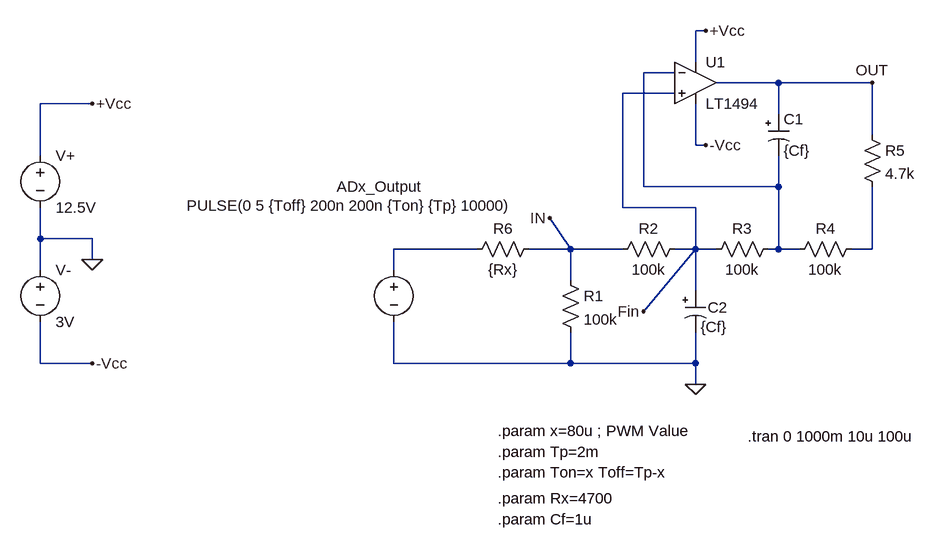
[diagram p0: schematic DAC_SIM01.asc]
DAC_SIM01.asc, the LTspice schematic file:
Version 4
SHEET 1 1124 680
WIRE 688 -304 672 -304
WIRE 672 -256 672 -304
WIRE 640 -240 592 -240
WIRE 800 -224 704 -224
WIRE 944 -224 800 -224
WIRE 640 -208 560 -208
WIRE -256 -192 -336 -192
WIRE 800 -176 800 -224
WIRE 944 -144 944 -224
WIRE 672 -128 672 -192
WIRE 688 -128 672 -128
WIRE -336 -112 -336 -192
WIRE 592 -64 592 -240
WIRE 800 -64 800 -112
WIRE 800 -64 592 -64
WIRE 560 -32 560 -208
WIRE 672 -32 560 -32
WIRE -336 16 -336 -32
WIRE -256 16 -336 16
WIRE 336 32 208 32
WIRE 480 32 448 -16
WIRE 480 32 416 32
WIRE 560 32 480 32
WIRE 672 32 672 -32
WIRE 672 32 640 32
WIRE 704 32 672 32
WIRE 800 32 800 -64
WIRE 800 32 784 32
WIRE 832 32 800 32
WIRE 944 32 944 -64
WIRE 944 32 912 32
WIRE -256 48 -256 16
WIRE -336 64 -336 16
WIRE 208 64 208 32
WIRE 480 80 480 32
WIRE 672 96 672 32
WIRE 592 128 672 32
WIRE -336 208 -336 144
WIRE -256 208 -336 208
WIRE 208 208 208 144
WIRE 480 208 480 160
WIRE 480 208 208 208
WIRE 672 208 672 160
WIRE 672 208 480 208
WIRE 672 240 672 208
FLAG 448 -16 IN
FLAG 672 240 0
FLAG -256 208 -Vcc
FLAG -256 -192 +Vcc
FLAG 688 -304 +Vcc
FLAG 688 -128 -Vcc
FLAG -256 48 0
FLAG 944 -224 OUT
FLAG 592 128 Fin
SYMBOL voltage 208 48 R0
WINDOW 3 -319 -83 Left 2
WINDOW 123 0 0 Left 0
WINDOW 39 0 0 Left 0
WINDOW 0 -88 -112 Left 2
SYMATTR Value PULSE(0 5 {Toff} 200n 200n {Ton} {Tp} 10000)
SYMATTR InstName ADx_Output
SYMBOL res 464 64 R0
SYMATTR InstName R1
SYMATTR Value 100k
SYMBOL res 544 48 R270
WINDOW 0 32 56 VTop 2
WINDOW 3 0 56 VBottom 2
SYMATTR InstName R2
SYMATTR Value 100k
SYMBOL res 800 16 R90
WINDOW 0 0 56 VBottom 2
WINDOW 3 32 56 VTop 2
SYMATTR InstName R3
SYMATTR Value 100k
SYMBOL res 928 16 R90
WINDOW 0 0 56 VBottom 2
WINDOW 3 32 56 VTop 2
SYMATTR InstName R4
SYMATTR Value 100k
SYMBOL res 928 -160 R0
SYMATTR InstName R5
SYMATTR Value 4.7k
SYMBOL OpAmps\\LT1494 672 -224 R0
SYMATTR InstName U1
SYMBOL polcap 784 -176 R0
SYMATTR InstName C1
SYMATTR Value {Cf}
SYMBOL polcap 656 96 R0
WINDOW 0 35 26 Left 2
SYMATTR InstName C2
SYMATTR Value {Cf}
SYMBOL voltage -336 48 R0
WINDOW 123 0 0 Left 0
WINDOW 39 0 0 Left 0
SYMATTR InstName V-
SYMATTR Value 3V
SYMBOL res 432 16 R90
WINDOW 0 0 56 VBottom 2
WINDOW 3 32 56 VTop 2
SYMATTR InstName R6
SYMATTR Value {Rx}
SYMBOL voltage -336 -128 R0
WINDOW 123 0 0 Left 0
WINDOW 39 0 0 Left 0
SYMATTR InstName V+
SYMATTR Value 12.5V
TEXT 368 312 Left 2 !.param x=80u ; PWM Value
TEXT 752 320 Left 2 !.tran 0 1000m 10u 100u
TEXT 368 376 Left 2 !.param Ton=x Toff=Tp-x
TEXT 368 344 Left 2 !.param Tp=2m
TEXT 368 416 Left 2 !.param Rx=4700
TEXT 368 448 Left 2 !.param Cf=1u

The netlist it stands for:
* DAC_SIM01.asc
V§ADx_Output N002 0 PULSE(0 5 {Toff} 200n 200n {Ton} {Tp} 10000)
R1 IN 0 100k
R2 IN Fin 100k
R3 N001 Fin 100k
R4 N003 N001 100k
R5 OUT N003 4.7k
* U1: LT1494 (symbol OpAmps\LT1494 not available, pins judged from their places): In+=Fin In-=N001 V+=+Vcc V-=-Vcc OUT=OUT
C1 OUT N001 {Cf}
C2 Fin 0 {Cf}
V- 0 -Vcc 3V
R6 IN N002 {Rx}
V+ +Vcc 0 12.5V
.param x=80u ; PWM Value
.tran 0 1000m 10u 100u
.param Ton=x Toff=Tp-x
.param Tp=2m
.param Rx=4700
.param Cf=1u
.backanno
.end